# Altium schematic sheet sar20-baseboard-Camera.SchDoc
size A4
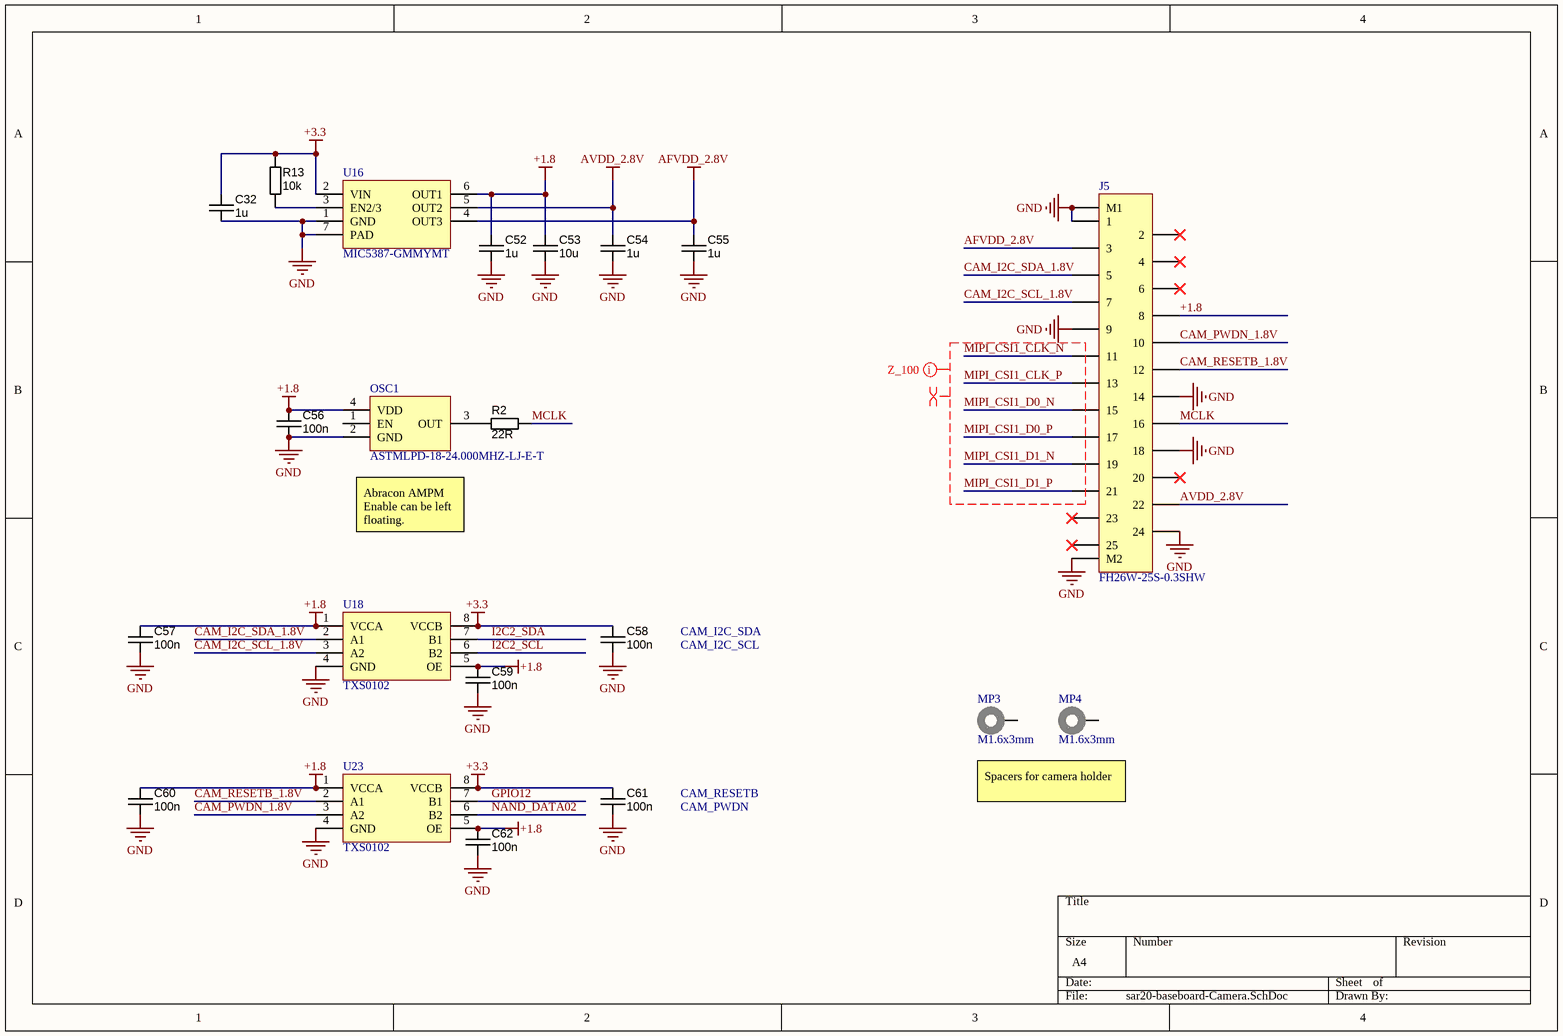
[diagram p0: sar20-baseboard-Camera.SchDoc]

## Parts
C32  1u  [CAPC1005X55N]
C52  1u  [CAPC1005X55N]
C53  value 10u  [CAPC1608X90N]  (hidden comment: approved sub OK)
C54  1u  [CAPC1005X55N]
C55  1u  [CAPC1005X55N]
C56  100n  [CAPC1005X55N]
C57  100n  [CAPC1005X55N]
C58  100n  [CAPC1005X55N]
C59  100n  [CAPC1005X55N]
C60  100n  [CAPC1005X55N]
C61  100n  [CAPC1005X55N]
C62  100n  [CAPC1005X55N]
J5  FH26W-25S-0.3SHW  [FH26W-25S-0.3SHW]
MP3  M1.6x3mm  [9774030633]
MP4  M1.6x3mm  [9774030633]
OSC1  ASTMLPD-18-24.000MHZ-LJ-E-T  [Abracon_AMPM_2.5x2.0]
R2  value 22R  [RESC1005X40N]  (hidden comment: Thick Film)
R13  value 10k  [RESC1005X40N]  (hidden comment: Thick Film)
U16  MIC5387-GMMYMT  [SON50P160X60_HS-7N]
U18  TXS0102  [TI_X2SON_DQM]
U23  TXS0102  [TI_X2SON_DQM]

## Nets
+1.8: C52.1 C53.1 C56.1 C57.1 C59.1 C60.1 C62.1 J5.8 OSC1.4(VDD) U16.6(OUT1) U18.1(VCCA) U18.5(OE) U23.1(VCCA) U23.5(OE)
+3.3: C32.1 C58.1 C61.1 R13.1 U16.2(VIN) U18.8(VCCB) U23.8(VCCB)
AFVDD_2.8V: C55.1 J5.3 U16.4(OUT3)
AVDD_2.8V: C54.1 J5.22 U16.5(OUT2)
GND: C32.2 C52.2 C53.2 C54.2 C55.2 C56.2 C57.2 C58.2 C59.2 C60.2 C61.2 C62.2 J5.1 J5.9 J5.14 J5.18 J5.24 J5.M1 J5.M2 OSC1.2(GND) U16.1(GND) U16.7(PAD) U18.4(GND) U23.4(GND)
CAM_I2C_SCL_1.8V: J5.7 U18.3(A2)
CAM_I2C_SDA_1.8V: J5.5 U18.2(A1)
CAM_PWDN_1.8V: J5.10 U23.3(A2)
CAM_RESETB_1.8V: J5.12 U23.2(A1)
GPIO12: U23.7(B1)
I2C2_SCL: U18.6(B2)
I2C2_SDA: U18.7(B1)
MCLK: J5.16 R2.2
MIPI_CSI1_CLK_N: J5.11
MIPI_CSI1_CLK_P: J5.13
MIPI_CSI1_D0_N: J5.15
MIPI_CSI1_D0_P: J5.17
MIPI_CSI1_D1_N: J5.19
MIPI_CSI1_D1_P: J5.21
NAND_DATA02: U23.6(B2)
NetOSC1_3: OSC1.3(OUT) R2.1
NetR13_2: R13.2 U16.3(EN2/3)

Not connected (* = marked no-connect by the designer): J5 2* 4* 6* 20* 23* 25*; MP3 1; MP4 1; OSC1 1(EN)

## Layout directives
differential pair; differential pair class Z_100: MIPI_CSI1_CLK_N, MIPI_CSI1_CLK_P, MIPI_CSI1_D0_N, MIPI_CSI1_D0_P, MIPI_CSI1_D1_N, MIPI_CSI1_D1_P
net class Z_100: MIPI_CSI1_CLK_N, MIPI_CSI1_CLK_P, MIPI_CSI1_D0_N, MIPI_CSI1_D0_P, MIPI_CSI1_D1_N, MIPI_CSI1_D1_P

## Notes on the sheet
- Abracon AMPM
  Enable can be left floating.
- CAM_I2C_SCL
- CAM_I2C_SDA
- CAM_PWDN
- CAM_RESETB
- Spacers for camera holder

## Library data of the parts
C32 C52 C54 C55 = CAPC_1u_0402_X5R_6V3_10%: Capacitor SMD Cer 1uF 10% 16V X5R 0402; Manufacturer 1: AVX Corporation; Manufacturer Part Number 1: 04026D105KAT2A; Ratings: 6.3V; X5R; SCDType: spec; Tolerance: ±10%; Operating Temperature: -55°C ~ 125°C; Package / Case: 0402 (1005 Metric); Size / Dimension: 0.039" L x 0.020" W (1.00mm x 0.50mm); Supplier 1: Digi-Key; Supplier Part Number 1: 478-2583-1-ND; RoHS 1: RoHS Compliant; ComponentLink1URL: http://www.avx.com/docs/Catalogs/cx5r.pdf; ComponentLink1Description: http://www.avx.com/docs/Catalogs/cx5r.pdf; Supplier 2: Digi-Key; Supplier Part Number 2: 311-1438-1-ND; Manufacturer 2: Yageo; Manufacturer Part Number 2: CC0402KRX5R5BB105; RoHS 2: RoHS Compliant; ComponentLink2URL: http://www.yageo.com/documents/recent/UPY-GPHC_X5R_4V-to-50V_12.pdf; ComponentLink2Description: http://www.yageo.com/documents/recent/UPY-GPHC_X5R_4V-to-50V_12.pdf; Supplier 3: Digi-Key; Supplier Part Number 3: 1276-1010-1-ND; Manufacturer 3: Samsung Electro-Mechanics America, Inc; Manufacturer Part Number 3: CL05A105KQ5NNNC; RoHS 3: RoHS Compliant; ComponentLink3URL: http://www.samsungsem.com/servlet/FileDownload?path=productsearch&sname=CL05A105KQ5NNNC.pdf&oname=CL05A105KQ5NNNC.pdf; ComponentLink3Description: http://www.samsungsem.com/servlet/FileDownload?path=productsearch&sname=CL05A105KQ5NNNC.pdf&oname=CL05A105KQ5NNNC.pdf; Supplier 4: Digi-Key; Supplier Part Number 4: 445-4998-1-ND; Manufacturer 4: TDK Corporation; Manufacturer Part Number 4: C1005X5R0J105K050BB; RoHS 4: RoHS Compliant; ComponentLink4URL: http://product.tdk.com/capacitor/mlcc/en/documents/mlcc_commercial_general_en.pdf; ComponentLink4Description: http://product.tdk.com/capacitor/mlcc/en/documents/mlcc_commercial_general_en.pdf; Supplier 5: Digi-Key; Supplier Part Number 5: 490-1320-1-ND; Manufacturer 5: Murata Electronics North America; Manufacturer Part Number 5: GRM155R60J105KE19D; RoHS 5: RoHS Compliant; ComponentLink5URL: http://www.murata.com/products/catalog/pdf/c02e.pdf; ComponentLink5Description: http://www.murata.com/products/catalog/pdf/c02e.pdf; Value: 1u
C53 = CAPC_2u2_0603_10V_10%: Capacitor SMD Cer 2.2uF 10% 10V X5R 0603; Manufacturer 1: AVX Corporation; Manufacturer Part Number 1: 0603ZD225KAT2A; Ratings: 10V; X5R; Material: ceramic; SCDType: spec; Package / Case: 0603 (1608 metric); Tolerance: ±10%; Supplier 1: Digi-Key; Supplier Part Number 1: 478-6212-1-ND; ComponentLink1URL: http://www.avx.com/docs/Catalogs/cx5r.pdf; ComponentLink1Description: http://www.avx.com/docs/Catalogs/cx5r.pdf
C56-C62 = CAPC_100n_0402_X5R_16V_10%: Capacitor SMD Cer 100nF 10% 16V X5R 0402; Manufacturer 1: AVX Corporation; Manufacturer Part Number 1: 0402YD104KAT2A; Ratings: 16V; X5R; SCDType: spec; Tolerance: ±10%; Operating Temperature: -55°C ~ 125°C; Package / Case: 0402 (1005 Metric); Size / Dimension: 0.039" L x 0.020" W (1.00mm x 0.50mm); Supplier 1: Digi-Key; Supplier Part Number 1: 478-1126-1-ND; ComponentLink1URL: http://www.avx.com/docs/Catalogs/cx5r.pdf; ComponentLink1Description: http://www.avx.com/docs/Catalogs/cx5r.pdf; Supplier 2: Digi-Key; Supplier Part Number 2: 311-1347-1-ND; Manufacturer 2: Yageo; Manufacturer Part Number 2: CC0402KRX5R7BB104; ComponentLink2URL: http://www.yageo.com/documents/recent/UPY-GPHC_X5R_4V-to-50V_12.pdf; ComponentLink2Description: http://www.yageo.com/documents/recent/UPY-GPHC_X5R_4V-to-50V_12.pdf; Value: 100n
MP3 MP4 = 9774030633: WA-SMSI SMT Steel Spacer, M1.6 Thread Internal, OD 3.3mm, M1.6x3mm; Manufacturer: Wurth Elektronik; Inner Diameter: 1.9mm; Surface: Tin; ComponentLink1Description: Manufacturer; ComponentLink1URL: http://www.we-online.de; ComponentLink2Description: Datasheet; ComponentLink2URL: https://www.we-online.com/catalog/datasheet/9774030633.pdf; Mounting Technology: SMT; Packaging: Bulk; Manufacturer Part Number: 9774030633; Length: 3mm; Inner Thread Length: -; Operating Temperature: -55 to +150degC; Outer Diameter: 3.3mm; Published Date: April 2020; Material: Steel; Thread: M1.6
OSC1 = Abracon AMPM
R2 = RES_10R_0402_5%: Resistor SMD chip 10 Ohm 0.063W 5% 0402; Manufacturer 1: Yageo; Manufacturer Part Number 1: RC0402JR-0710RL; Ratings: 1/16 W; SCDType: spec; Package / Case: 0402 (1005 Metric); Tolerance: ±5%; Supplier 1: Digi-Key; Supplier Part Number 1: 311-10JRCT-ND; RoHS 1: RoHS Compliant; ComponentLink1URL: http://www.yageo.com/documents/recent/PYu-RC0402_51_RoHS_L_6.pdf; ComponentLink1Description: http://www.yageo.com/documents/recent/PYu-RC0402_51_RoHS_L_6.pdf; Supplier 2: Digi-Key; Supplier Part Number 2: RHM10CECT-ND; Manufacturer 2: Rohm Semiconductor; Manufacturer Part Number 2: MCR01MRTJ100; RoHS 2: RoHS Compliant; ComponentLink2URL: http://rohmfs.rohm.com/en/products/databook/datasheet/passive/resistor/chip_resistor/mcr_g.pdf; ComponentLink2Description: http://rohmfs.rohm.com/en/products/databook/datasheet/passive/resistor/chip_resistor/mcr_g.pdf; Supplier 3: Digi-Key; Supplier Part Number 3: 541-10JCT-ND; Manufacturer 3: Vishay Dale; Manufacturer Part Number 3: CRCW040210R0JNED; RoHS 3: RoHS Compliant; ComponentLink3URL: http://www.vishay.com/doc?20035; ComponentLink3Description: http://www.vishay.com/doc?20035; Supplier 4: Digi-Key; Supplier Part Number 4: RMCF0402JT10R0CT-ND; Manufacturer 4: Stackpole Electronics Inc; Manufacturer Part Number 4: RMCF0402JT10R0; RoHS 4: RoHS Compliant; ComponentLink4URL: http://www.seielect.com/Catalog/SEI-RMCF_RMCP.pdf; ComponentLink4Description: http://www.seielect.com/Catalog/SEI-RMCF_RMCP.pdf; Supplier 5: Digi-Key; Supplier Part Number 5: 1276-4328-1-ND; Manufacturer 5: Samsung Electro-Mechanics America, Inc; Manufacturer Part Number 5: RC1005J100CS; RoHS 5: RoHS Compliant; ComponentLink5URL: http://www.samsungsem.com/servlet/FileDownload?filename=productcatalog/pdf/Chip_Resistor.pdf; ComponentLink5Description: http://www.samsungsem.com/servlet/FileDownload?filename=productcatalog/pdf/Chip_Resistor.pdf
R13 = RES_10K_0402_1%: Resistor SMD chip 10k Ohm 0.063W 1% 0402; Manufacturer 1: Vishay Dale; Manufacturer Part Number 1: CRCW040210K0FKED; Ratings: 1/16 W; SCDType: spec; Package / Case: 0402 (1005 Metric); Manufacturer 2: Yageo; Manufacturer Part Number 2: RC0402FR-0710KL; Supplier 1: Digi-Key; Supplier Part Number 1: 541-10.0KLCT-ND; ComponentLink1URL: http://www.vishay.com/doc?20035; ComponentLink1Description: http://www.vishay.com/doc?20035; Supplier 2: Digi-Key; Supplier Part Number 2: 311-10.0KLRCT-ND; ComponentLink2URL: http://www.yageo.com/documents/recent/PYu-RC0402_51_RoHS_L_6.pdf; ComponentLink2Description: http://www.yageo.com/documents/recent/PYu-RC0402_51_RoHS_L_6.pdf; Tolerance: ±1%
U16 = MIC5387